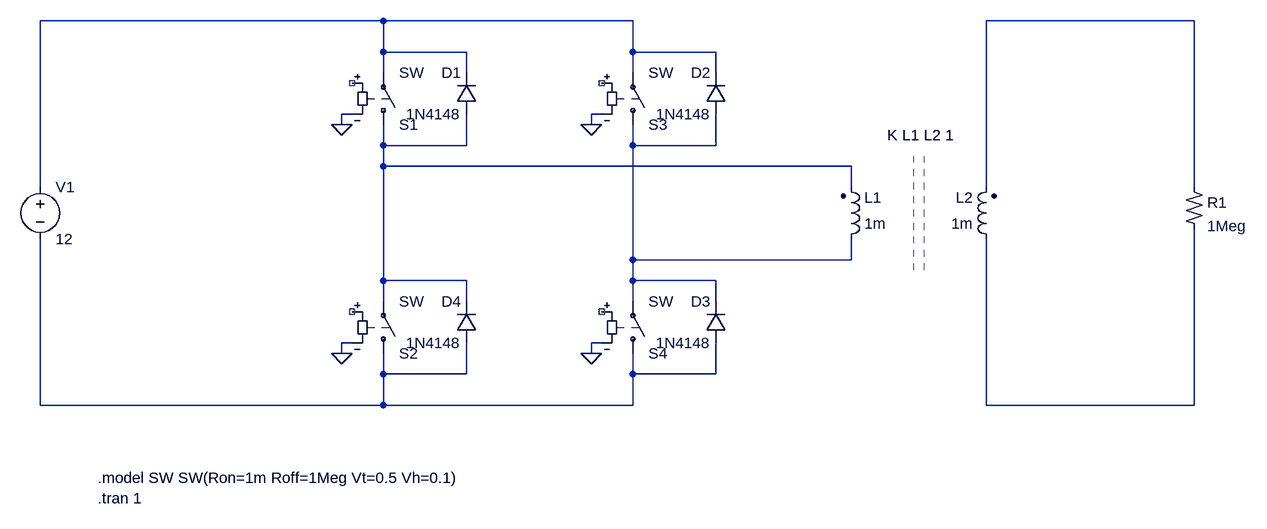
[diagram p0: schematic single-phase-inverter_v1p0.asc]
single-phase-inverter_v1p0.asc, the LTspice schematic file:
Version 4
SHEET 1 1524 836
WIRE 192 96 -336 96
WIRE 576 96 192 96
WIRE 1440 96 1120 96
WIRE 192 144 192 96
WIRE 320 144 192 144
WIRE 576 144 576 96
WIRE 704 144 576 144
WIRE 192 176 192 144
WIRE 320 176 320 144
WIRE 576 176 576 144
WIRE 704 176 704 144
WIRE 144 240 128 240
WIRE 528 240 512 240
WIRE 128 256 128 240
WIRE 512 256 512 240
WIRE 192 288 192 256
WIRE 320 288 320 240
WIRE 320 288 192 288
WIRE 576 288 576 256
WIRE 704 288 704 240
WIRE 704 288 576 288
WIRE 192 320 192 288
WIRE 912 320 192 320
WIRE -336 352 -336 96
WIRE 912 352 912 320
WIRE 1120 352 1120 96
WIRE 1440 352 1440 96
WIRE 576 464 576 288
WIRE 912 464 912 432
WIRE 912 464 576 464
WIRE 192 496 192 320
WIRE 320 496 192 496
WIRE 576 496 576 464
WIRE 704 496 576 496
WIRE 192 528 192 496
WIRE 320 528 320 496
WIRE 576 528 576 496
WIRE 704 528 704 496
WIRE 144 592 128 592
WIRE 528 592 512 592
WIRE 128 608 128 592
WIRE 512 608 512 592
WIRE 192 640 192 608
WIRE 320 640 320 592
WIRE 320 640 192 640
WIRE 576 640 576 608
WIRE 704 640 704 592
WIRE 704 640 576 640
WIRE -336 688 -336 432
WIRE 192 688 192 640
WIRE 192 688 -336 688
WIRE 576 688 576 640
WIRE 576 688 192 688
WIRE 1120 688 1120 432
WIRE 1440 688 1440 416
WIRE 1440 688 1120 688
FLAG 512 256 0
FLAG 512 608 0
FLAG 128 608 0
FLAG 128 256 0
SYMBOL sw 192 272 M180
SYMATTR InstName S1
SYMBOL sw 192 624 M180
SYMATTR InstName S2
SYMBOL sw 576 272 M180
SYMATTR InstName S3
SYMBOL sw 576 624 M180
SYMATTR InstName S4
SYMBOL voltage -336 336 R0
SYMATTR InstName V1
SYMATTR Value 12
SYMATTR SpiceLine Rser=1m
SYMBOL ind2 896 448 M180
WINDOW 0 36 80 Left 2
WINDOW 3 36 40 Left 2
SYMATTR InstName L1
SYMATTR Value 1m
SYMBOL ind2 1136 448 R180
WINDOW 0 36 80 Left 2
WINDOW 3 36 40 Left 2
SYMATTR InstName L2
SYMATTR Value 1m
SYMBOL diode 336 240 R180
WINDOW 0 24 64 Left 2
WINDOW 3 24 0 Left 2
SYMATTR InstName D1
SYMATTR Value 1N4148
SYMBOL diode 720 240 R180
WINDOW 0 24 64 Left 2
WINDOW 3 24 0 Left 2
SYMATTR InstName D2
SYMATTR Value 1N4148
SYMBOL diode 720 592 R180
WINDOW 0 24 64 Left 2
WINDOW 3 24 0 Left 2
SYMATTR InstName D3
SYMATTR Value 1N4148
SYMBOL diode 336 592 R180
WINDOW 0 24 64 Left 2
WINDOW 3 24 0 Left 2
SYMATTR InstName D4
SYMATTR Value 1N4148
SYMBOL res2 1424 352 R0
SYMATTR InstName R1
SYMATTR Value 1Meg
TEXT -248 800 Left 2 !.model SW SW(Ron=1m Roff=1Meg Vt=0.5 Vh=0.1)\n.tran 1
TEXT 968 272 Left 2 !K L1 L2 1
LINE Normal 1008 304 1008 480 2
LINE Normal 1024 304 1024 480 2

The netlist it stands for:
* single-phase-inverter_v1p0.asc
S1 N003 N001 NC_01 0 SW
S2 N005 N003 NC_02 0 SW
S3 N004 N001 NC_03 0 SW
S4 N005 N004 NC_04 0 SW
V1 N001 N005 12 Rser=1m
L1 N004 N003 1m
L2 N006 N002 1m
D1 N003 N001 1N4148
D2 N004 N001 1N4148
D3 N005 N004 1N4148
D4 N005 N003 1N4148
R1 N002 N006 1Meg
.model D D
.lib standard.dio
.model SW SW(Ron=1m Roff=1Meg Vt=0.5 Vh=0.1)
.tran 1
K L1 L2 1
.backanno
.end